# Altium schematic sheet Sheet1.SchDoc: Driver Board For CNC
size A3; Author: veres; CompanyName: VR; DrawnBy: Vladimir; Engineer: Vladimir; Revision: 2.0; SheetNumber: 1; SheetTotal: 1
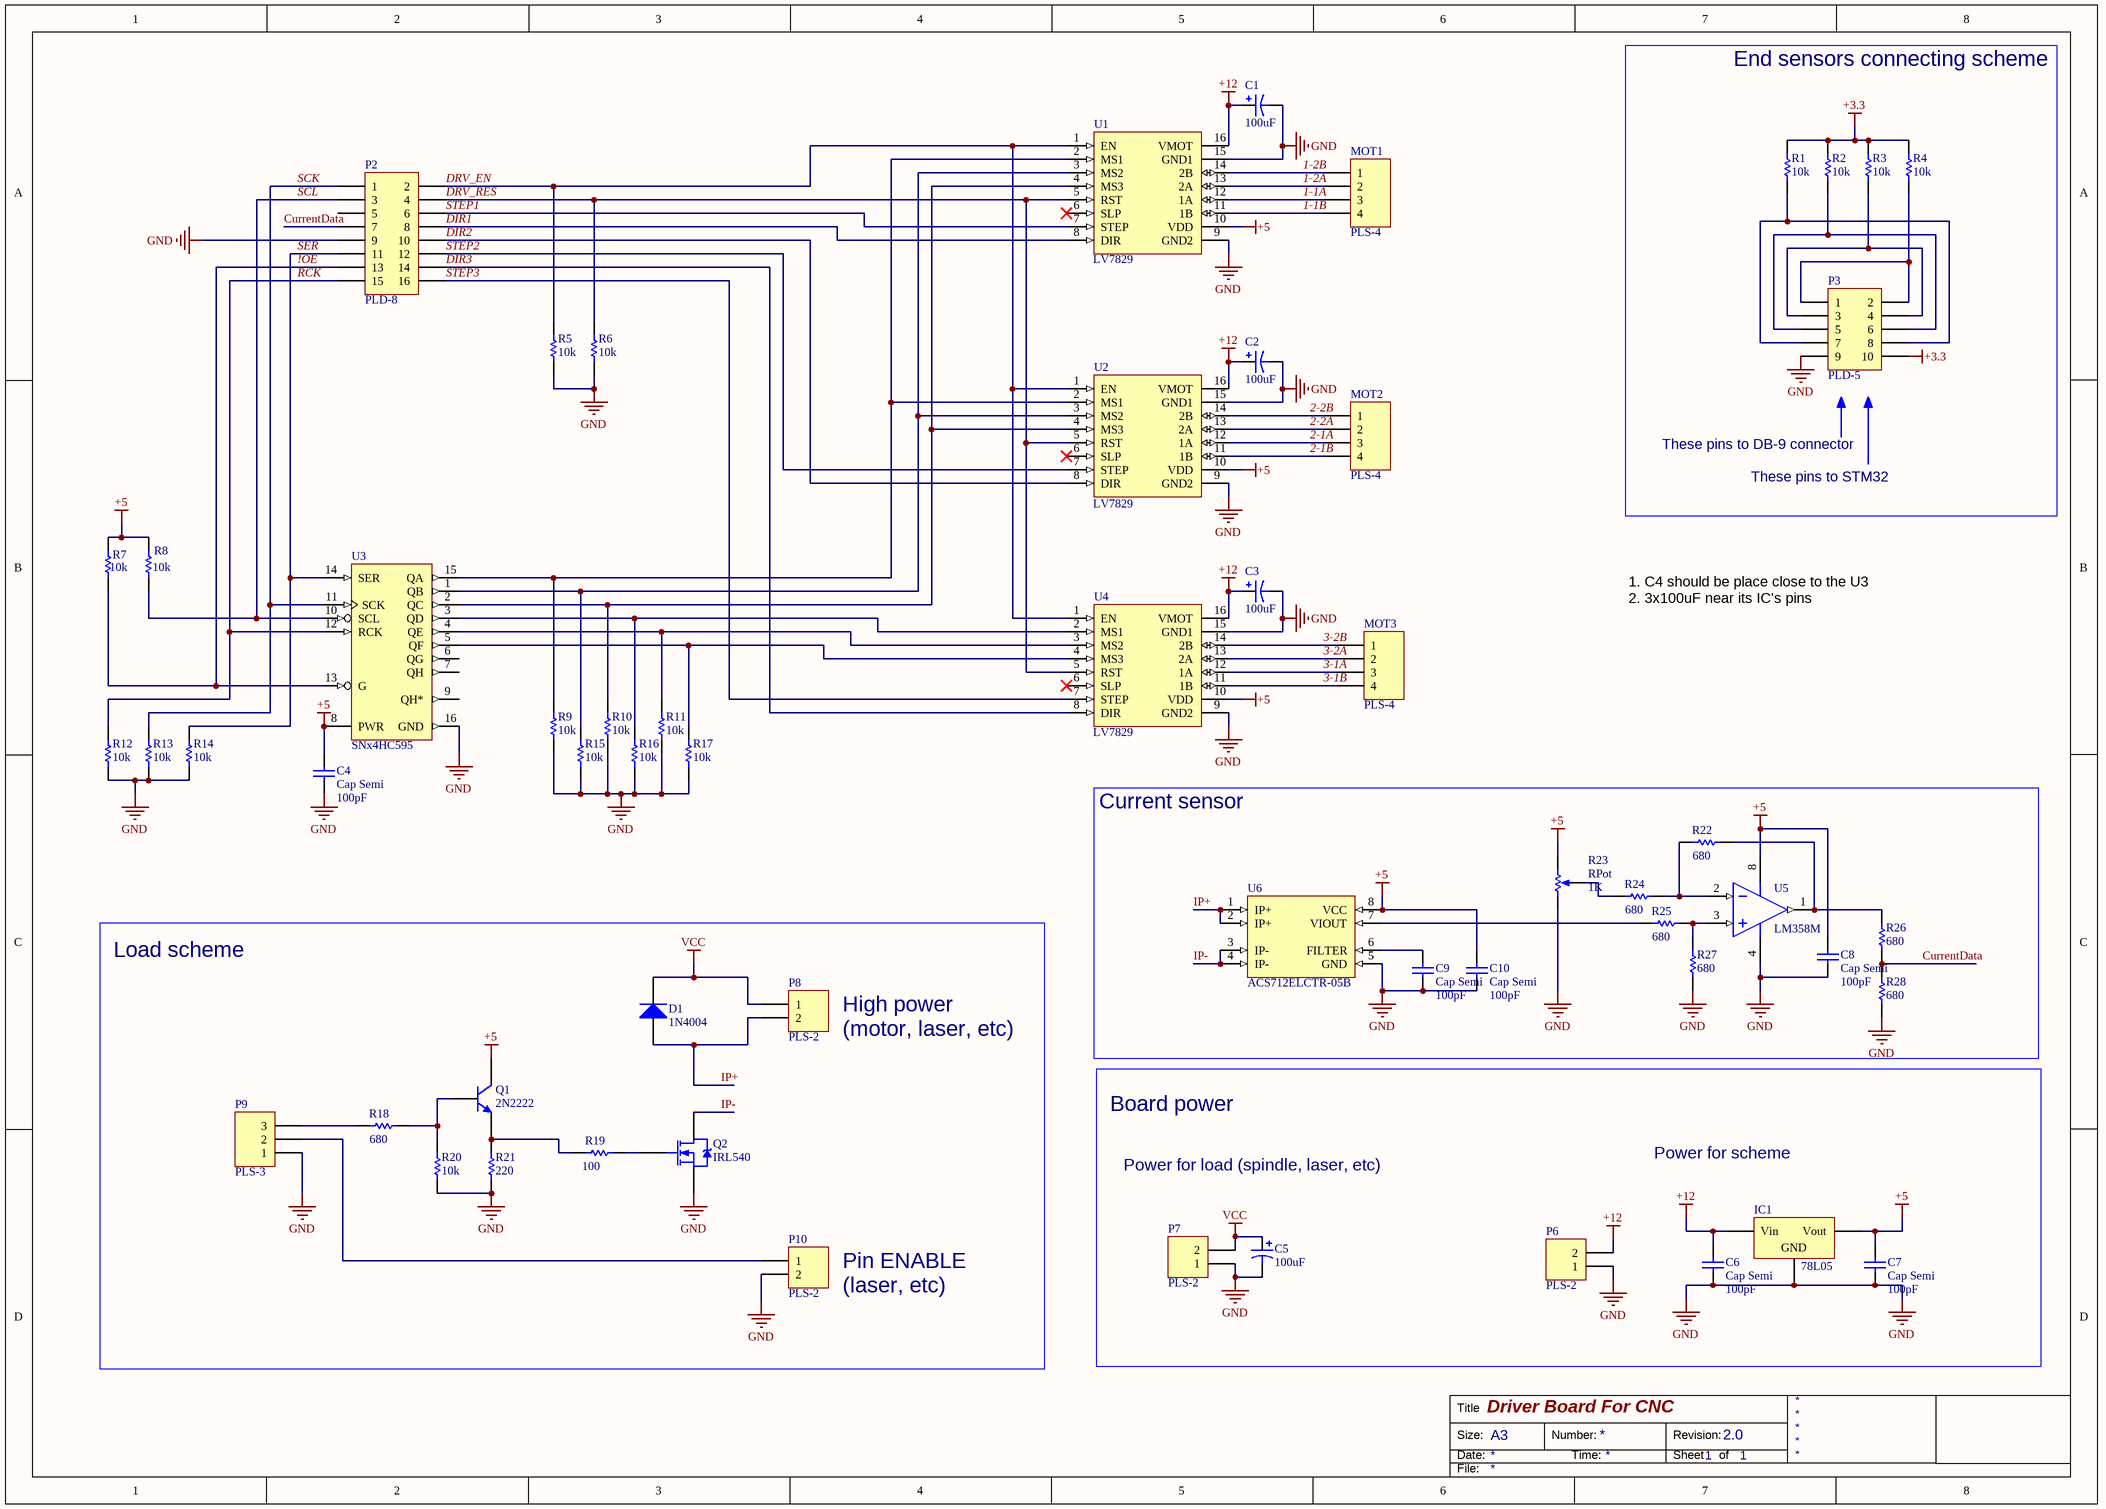
[diagram p0: Sheet1.SchDoc]

## Parts
C1  value 100uF  [UD-6,3X5,8_NICHICON]  (hidden comment: Cap Pol1)
C2  value 100uF  [UD-6,3X5,8_NICHICON]  (hidden comment: Cap Pol1)
C3  value 100uF  [UD-6,3X5,8_NICHICON]  (hidden comment: Cap Pol1)
C4  Cap Semi  value 100pF  [C1206]
C5  value 100uF  [UD-6,3X5,8_NICHICON]  (hidden comment: Cap Pol1)
C6  Cap Semi  value 100pF  [C1206]
C7  Cap Semi  value 100pF  [C1206]
C8  Cap Semi  value 100pF  [C1206]
C9  Cap Semi  value 100pF  [C1206]
C10  Cap Semi  value 100pF  [C1206]
D1  1N4004  [DO-41]
IC1  78L05  [TO92]
MOT1  PLS-4  [HDR1X4]
MOT2  PLS-4  [HDR1X4]
MOT3  PLS-4  [HDR1X4]
P2  PLD-8  [HDR2X8]
P3  PLD-5  [HDR2X5]
P6  PLS-2  [W237-102]
P7  PLS-2  [W237-102]
P8  PLS-2  [W237-102]
P9  PLS-3  [HDR1X3]
P10  PLS-2  [HDR1X2]
Q1  2N2222  [TO92]
Q2  IRL540  [TO220BV]
R1  value 10k  [RES-0805]  (hidden comment: ERA6Y)
R2  value 10k  [RES-0805]  (hidden comment: ERA6Y)
R3  value 10k  [RES-0805]  (hidden comment: ERA6Y)
R4  value 10k  [RES-0805]  (hidden comment: ERA6Y)
R5  value 10k  [RES-0805]  (hidden comment: ERA6Y)
R6  value 10k  [RES-0805]  (hidden comment: ERA6Y)
R7  10k  [RES-0805]
R8  10k  [RES-0805]
R9  value 10k  [RES-0805]  (hidden comment: ERA6Y)
R10  value 10k  [RES-0805]  (hidden comment: ERA6Y)
R11  value 10k  [RES-0805]  (hidden comment: ERA6Y)
R12  value 10k  [RES-0805]  (hidden comment: ERA6Y)
R13  value 10k  [RES-0805]  (hidden comment: ERA6Y)
R14  value 10k  [RES-0805]  (hidden comment: ERA6Y)
R15  value 10k  [RES-0805]  (hidden comment: ERA6Y)
R16  value 10k  [RES-0805]  (hidden comment: ERA6Y)
R17  value 10k  [RES-0805]  (hidden comment: ERA6Y)
R18  680  [RES-0805]
R19  value 100  [RES-0805]  (hidden comment: ERA6Y)
R20  value 10k  [RES-0805]  (hidden comment: ERA6Y)
R21  value 220  [RES-0805]  (hidden comment: ERA6Y)
R22  680  [RES-0805]
R23  RPot  value 1K  [VR5]
R24  680  [RES-0805]
R25  680  [RES-1206]
R26  680  [RES-0805]
R27  680  [RES-0805]
R28  680  [RES-0805]
U1  LV7829  [LV8729_BREAKOUT]
U2  LV7829  [LV8729_BREAKOUT]
U3  SNx4HC595  [SO16]
U4  LV7829  [LV8729_BREAKOUT]
U5  LM358M  [SO-8_L]
U6  ACS712ELCTR-05B  [SO-8_L]

## Blocks framed on the sheet
End sensors connecting scheme: P3 R1-R4
Current sensor: C8-C10 R22-R28 U5 U6
Load scheme: D1 P8-P10 Q1 Q2 R18-R21
Board power: C5-C7 IC1 P6 P7

## Nets
+3.3: P3.10 R1.1 R2.1 R3.1 R4.1
+5: C4.2 C7.2 C8.1 C10.2 IC1.3(Vout) Q1.1(C) R7.1 R8.1 R23.3(BOT) U1.10(VDD) U2.10(VDD) U3.8(PWR) U4.10(VDD) U5.8(V+) U6.8(VCC)
+12: C1.1 C2.1 C3.1 C6.2 IC1.1(Vin) P6.2 U1.16(VMOT) U2.16(VMOT) U4.16(VMOT)
GND: C1.2 C2.2 C3.2 C4.1 C5.2 C6.1 C7.1 C8.2 C9.1 C10.1 IC1.2(GND) P2.9 P3.9 P6.1 P7.1 P9.1 P10.2 Q2.3(S) R5.2 R6.2 R9.2 R10.2 R11.2 R12.2 R13.2 R14.2 R15.2 R16.2 R17.2 R20.2 R21.2 R23.1(TOP) R27.2 R28.2 U1.9(GND2) U1.15(GND1) U2.9(GND2) U2.15(GND1) U3.16(GND) U4.9(GND2) U4.15(GND1) U5.4(V-) U6.5(GND)
VCC: C5.1 D1.2(K) P7.2 P8.1
1-1A: MOT1.3 U1.12(1A)
1-1B: MOT1.4 U1.11(1B)
1-2A: MOT1.2 U1.13(2A)
1-2B: MOT1.1 U1.14(2B)
2-1A: MOT2.3 U2.12(1A)
2-1B: MOT2.4 U2.11(1B)
2-2A: MOT2.2 U2.13(2A)
2-2B: MOT2.1 U2.14(2B)
3-1A: MOT3.3 U4.12(1A)
3-1B: MOT3.4 U4.11(1B)
3-2A: MOT3.2 U4.13(2A)
3-2B: MOT3.1 U4.14(2B)
!OE: P2.13 R7.2 U3.13(G)
CurrentData: P2.7 R26.2 R28.1
DIR1: P2.8 U1.8(DIR)
DIR2: P2.10 U2.8(DIR)
DIR3: P2.14 U4.8(DIR)
DRV_EN: P2.2 R5.1 U1.1(EN) U2.1(EN) U4.1(EN)
DRV_RES: P2.4 R6.1 U1.5(RST) U2.5(RST) U4.5(RST)
IP+: D1.1(A) P8.2 U6.1(IP+) U6.2(IP+)
IP-: Q2.2(D) U6.3(IP-) U6.4(IP-)
RCK: P2.15 R12.1 U3.12(RCK)
SCK: P2.1 R13.1 U3.11(SCK)
SCL: P2.3 R8.2 U3.10(SCL)
SER: P2.11 R14.1 U3.14(SER)
STEP1: P2.6 U1.7(STEP)
STEP2: P2.12 U2.7(STEP)
STEP3: P2.16 U4.7(STEP)
NetC9_2: C9.2 U6.6(FILTER)
NetP3_1: P3.1 P3.2 R4.2
NetP3_3: P3.3 P3.4 R3.2
NetP3_5: P3.5 P3.6 R2.2
NetP3_7: P3.7 P3.8 R1.2
NetP9_2: P9.2 P10.1
NetP9_3: P9.3 R18.2
NetQ1_2: Q1.2(B) R18.1 R20.1
NetQ1_3: Q1.3(E) R19.2 R21.1
NetQ2_1: Q2.1(G) R19.1
NetR9_1: R9.1 U1.2(MS1) U2.2(MS1) U3.15(QA)
NetR10_1: R10.1 U1.4(MS3) U2.4(MS3) U3.2(QC)
NetR11_1: R11.1 U3.4(QE) U4.3(MS2)
NetR15_1: R15.1 U1.3(MS2) U2.3(MS2) U3.1(QB)
NetR16_1: R16.1 U3.3(QD) U4.2(MS1)
NetR17_1: R17.1 U3.5(QF) U4.4(MS3)
NetR22_1: R22.1 R26.1 U5.1(OUT)
NetR22_2: R22.2 R24.1 U5.2(IN-)
NetR23_2: R23.2(TAP) R24.2
NetR25_1: R25.1 R27.1 U5.3(IN+)
NetR25_2: R25.2 U6.7(VIOUT)

Not connected (* = marked no-connect by the designer): P2 5; U1 6(SLP)*; U2 6(SLP)*; U3 6(QG) 7(QH) 9(QH*); U4 6(SLP)*

## Notes on the sheet
- These pins to DB-9 connector
- These pins to STM32
- 1. C4 should be place close to the U3
  2. 3x100uF near its IC's pins
- High power
  (motor, laser, etc)
- Power for load (spindle, laser, etc)
- Power for scheme
- Pin ENABLE
  (laser, etc)
- Title
- Size:
- Date:
- A3
- Number:
- Time:
- Revision:
- Sheet
- of
- File:

## Library data of the parts
C1-C3 C5 = Cap Pol1: Polarized Capacitor (Radial); Published: 8-Jun-2000; LatestRevisionDate: 17-Jul-2002; LatestRevisionNote: Re-released for DXP Platform.; PackageReference: RB7.6-15; Publisher: Altium Limited; PackageDescription: Polarized Capacitor (Radial); 2 Leads
C4 C6-C10 = Cap Semi: Capacitor (Semiconductor SIM Model); Published: 8-Jun-2000; LatestRevisionDate: 29-May-2009; LatestRevisionNote: IPC-7351 Footprint Added.; PackageReference: C1206; Publisher: Altium Limited; PackageDescription: Chip Capacitor
D1 = Diode 1N4004: 1 Amp General Purpose Rectifier; Published: 8-Jun-2000; LatestRevisionDate: 17-Jul-2002; LatestRevisionNote: Re-released for DXP Platform.; DatasheetVersion: 1998; PackageVersion: Aug-1999; PackageReference: DO-41; Publisher: Altium Limited; PackageDescription: Diode, Axial; Body 5.2 x 2.7 mm (LxDia. max), Lead Dia. 0.86 mm (max); Code_JEDEC: DO-204-AL; ComponentLink1Description: Manufacturer Link; ComponentLink1URL: http://www.fairchildsemi.com/; ComponentLink2Description: Datasheet; ComponentLink2URL: http://www.fairchildsemi.com/ds/1N%2F1N4001.pdf; Value: 1N4004
IC1 = Volt Reg: Voltage Regulator; Published: 24-Mar-1999; LatestRevisionDate: 29-May-2009; LatestRevisionNote: IPC-7351 Footprint Added.; PackageReference: D2PAK; Publisher: Altium Limited; PackageDescription: 3-Pin Transistor Outline Package 2.54 mm Pitch, 15.1 mm Lead Span
MOT1-MOT3 = Header 4: Header, 4-Pin; LatestRevisionDate: 17-Jul-2002; LatestRevisionNote: Re-released for DXP Platform.; Publisher: Altium Limited; Value: PLS-4
P2 = Header 8X2: Header, 8-Pin, Dual row; LatestRevisionDate: 17-Jul-2002; LatestRevisionNote: Re-released for DXP Platform.; Publisher: Altium Limited; Value: PLD-8
P3 = Header 5X2: Header, 5-Pin, Dual row; LatestRevisionDate: 17-Jul-2002; LatestRevisionNote: Re-released for DXP Platform.; Publisher: Altium Limited; Value: PLD-5
P6-P8 P10 = Header 2: Header, 2-Pin; Manufacturer: AMPHENOL; Value2: DS1021-1x2; LatestRevisionDate: 17-Jul-2002; LatestRevisionNote: Re-released for DXP Platform.; Publisher: Altium Limited; Value1: PLS-2
P9 = Header 3: Header, 3-Pin; Value2: DS1021-1x3; LatestRevisionDate: 17-Jul-2002; LatestRevisionNote: Re-released for DXP Platform.; Publisher: Altium Limited; Value1: PLS-3
Q1 = NPN: NPN Bipolar Transistor; Published: 8-Jun-2000; LatestRevisionDate: 17-Jul-2002; LatestRevisionNote: Re-released for DXP Platform.; PackageReference: TO-226-AA; Publisher: Altium Limited; PackageDescription: TO, Flat Index; 3 In-Line, Axial Leads; Body Dia. 4.8mm; Leads 0.55 x 0.51 mm (max); Code_JEDEC: TO-226-AA; Value: 2N2222
Q2 = NMOS-2: N-Channel Power MOSFET; Note: Pin 2 is electrically connected to pin 4.; Published: 8-Jun-2000; LatestRevisionDate: 17-Jul-2002; LatestRevisionNote: Re-released for DXP Platform.; DatasheetVersion: PD-9.814; PackageVersion: Feb-1997; PackageReference: TO-220AB; Publisher: Altium Limited; PackageDescription: TO, Thru-Hole, Vertical, Heatsink Mounted; 3 In-Line Leads; Pitch 2.54 mm; ComponentLink1Description: Manufacturer Link; ComponentLink1URL: http://www.irf.com/; Value: IRL540
R1-R22 R24-R28 = ERA6Y: Rectangular Thick Film Chip Resistor, 10 Ohm to 1M Ohm Range, 0.1% and 0.5% Tolerance, 0805 Size, 0.1 W; Note: If flow soldering, adjust pad width of PCB Footprint to 0.7 - 0.8 times the width of the resistor.; Published: 17-Dec-2003; LatestRevisionDate: 19-Mar-2004; LatestRevisionNote: Silkscreen size reduced.; PackageDocument: Mar-2003; PackageReference: ERA-0805; Publisher: Altium Limited; Code_IPC: 2012 [0805]; ComponentLink1Description: Manufacturer Link; ComponentLink1URL: http://www.panasonic.com/industrial/components/resistive_products.htm; ComponentLink2Description: Datasheet; ComponentLink2URL: http://www.panasonic.com/industrial/components/pdf/AOA0000CE8.pdf
  R7 R8: Value: 10k
  R18 R22 R24-R28: Value: 680
R23 = RPot: Potentiometer; Sim Note: Enter the Resistance value and the set point into parameter fields.; Set Position: 0.5; Published: 8-Jun-2000; LatestRevisionDate: 17-Jul-2002; LatestRevisionNote: Re-released for DXP Platform.; PackageReference: VR5; Publisher: Altium Limited; PackageDescription: Variable Resistor, Thru-Hole; 3 Leads
U1 = LV7829: Quad Bidir ESD protection; Internal_Part_Number: MCD-00247; Manufacturer_Part_Number: ESDA6V1BC6; Manufacturer: STMICROELECTRONICS; Part_Type: Diode; BMS_Part_Number: 9179038; Provided_By: SUBCO with ST control; ECCN_US: EAR99; ECCN_EU: NEC; Initial_Board_Reference: MB1311; ComponentLink1Description: Datasheet; Status: Released; ComponentLink1URL: http://tunmcdsvn.tun.st.com/Component_Datasheet_Library/Trunk/Diodes/STM_ESD_ESDA6V1BC6; Value: LV7829
U2 U4 = LV7829: Quad Bidir ESD protection; Internal_Part_Number: MCD-00247; Manufacturer_Part_Number: ESDA6V1BC6; Manufacturer: STMICROELECTRONICS; Part_Type: Diode; BMS_Part_Number: 9179038; Provided_By: SUBCO with ST control; ECCN_US: EAR99; ECCN_EU: NEC; Initial_Board_Reference: MB1311; Value: SNx4HC595; ComponentLink1Description: Datasheet; Status: Released; ComponentLink1URL: http://tunmcdsvn.tun.st.com/Component_Datasheet_Library/Trunk/Diodes/STM_ESD_ESDA6V1BC6
U3 = SNx4HC595: Quad Bidir ESD protection; Internal_Part_Number: MCD-00247; Manufacturer_Part_Number: ESDA6V1BC6; Manufacturer: STMICROELECTRONICS; Part_Type: Diode; BMS_Part_Number: 9179038; Provided_By: SUBCO with ST control; ECCN_US: EAR99; ECCN_EU: NEC; Initial_Board_Reference: MB1311; ComponentLink1Description: Datasheet; Status: Released; ComponentLink1URL: http://tunmcdsvn.tun.st.com/Component_Datasheet_Library/Trunk/Diodes/STM_ESD_ESDA6V1BC6; Value: SNx4HC595
U5 = Op Amp: FET Operational Amplifier; Published: 8-Jun-2000; LatestRevisionDate: 17-Jul-2002; LatestRevisionNote: Re-released for DXP Platform.; DatasheetVersion: REV. B; PackageVersion: 1990; PackageReference: H-08A; Publisher: Altium Limited; PackageDescription: Can; 8 Leads; Pin Circle Dia. 5.08 mm; Lead Dia. 0.53 mm (max); ComponentLink1Description: Manufacturer Link; ComponentLink1URL: http://www.analog.com/; Value: LM358M
U6 = ACS712ELCTR-05B: Quad Bidir ESD protection; Internal_Part_Number: MCD-00247; Manufacturer_Part_Number: ESDA6V1BC6; Manufacturer: STMICROELECTRONICS; Part_Type: Diode; BMS_Part_Number: 9179038; Provided_By: SUBCO with ST control; ECCN_US: EAR99; ECCN_EU: NEC; Initial_Board_Reference: MB1311; ComponentLink1Description: Datasheet; Status: Released; ComponentLink1URL: http://tunmcdsvn.tun.st.com/Component_Datasheet_Library/Trunk/Diodes/STM_ESD_ESDA6V1BC6; Value: ACS712ELCTR-05B